# EAGLE design SHARKSKYFC (EAGLE 9.5.1)
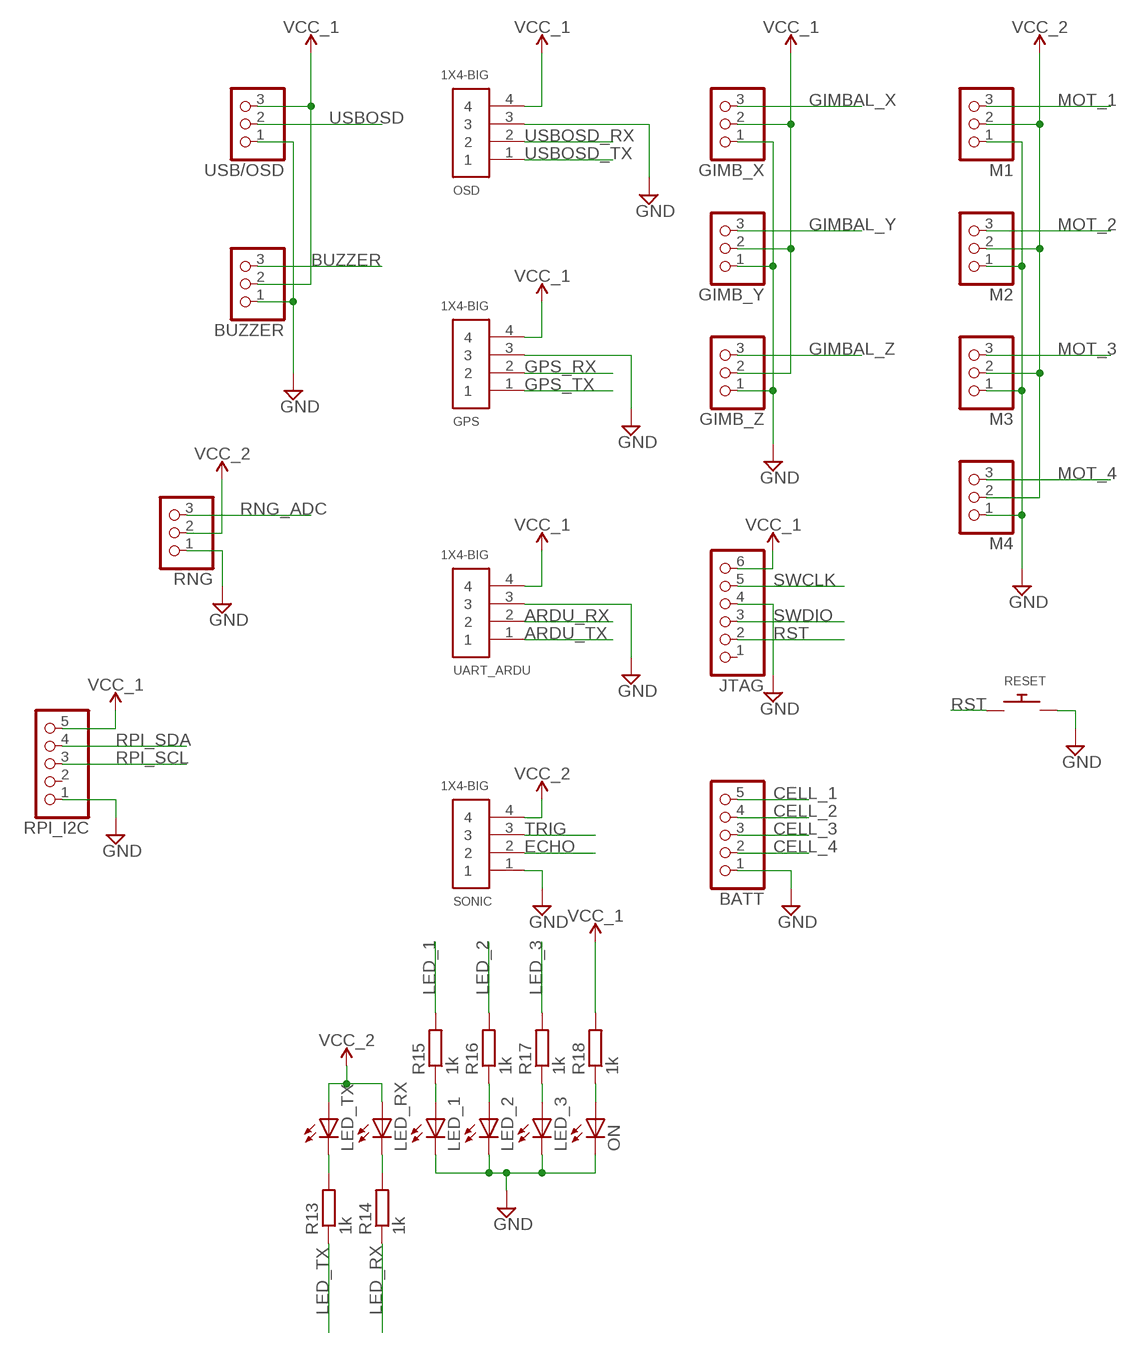
[diagram p0: schematic, sheet 1, part 1 of 2]
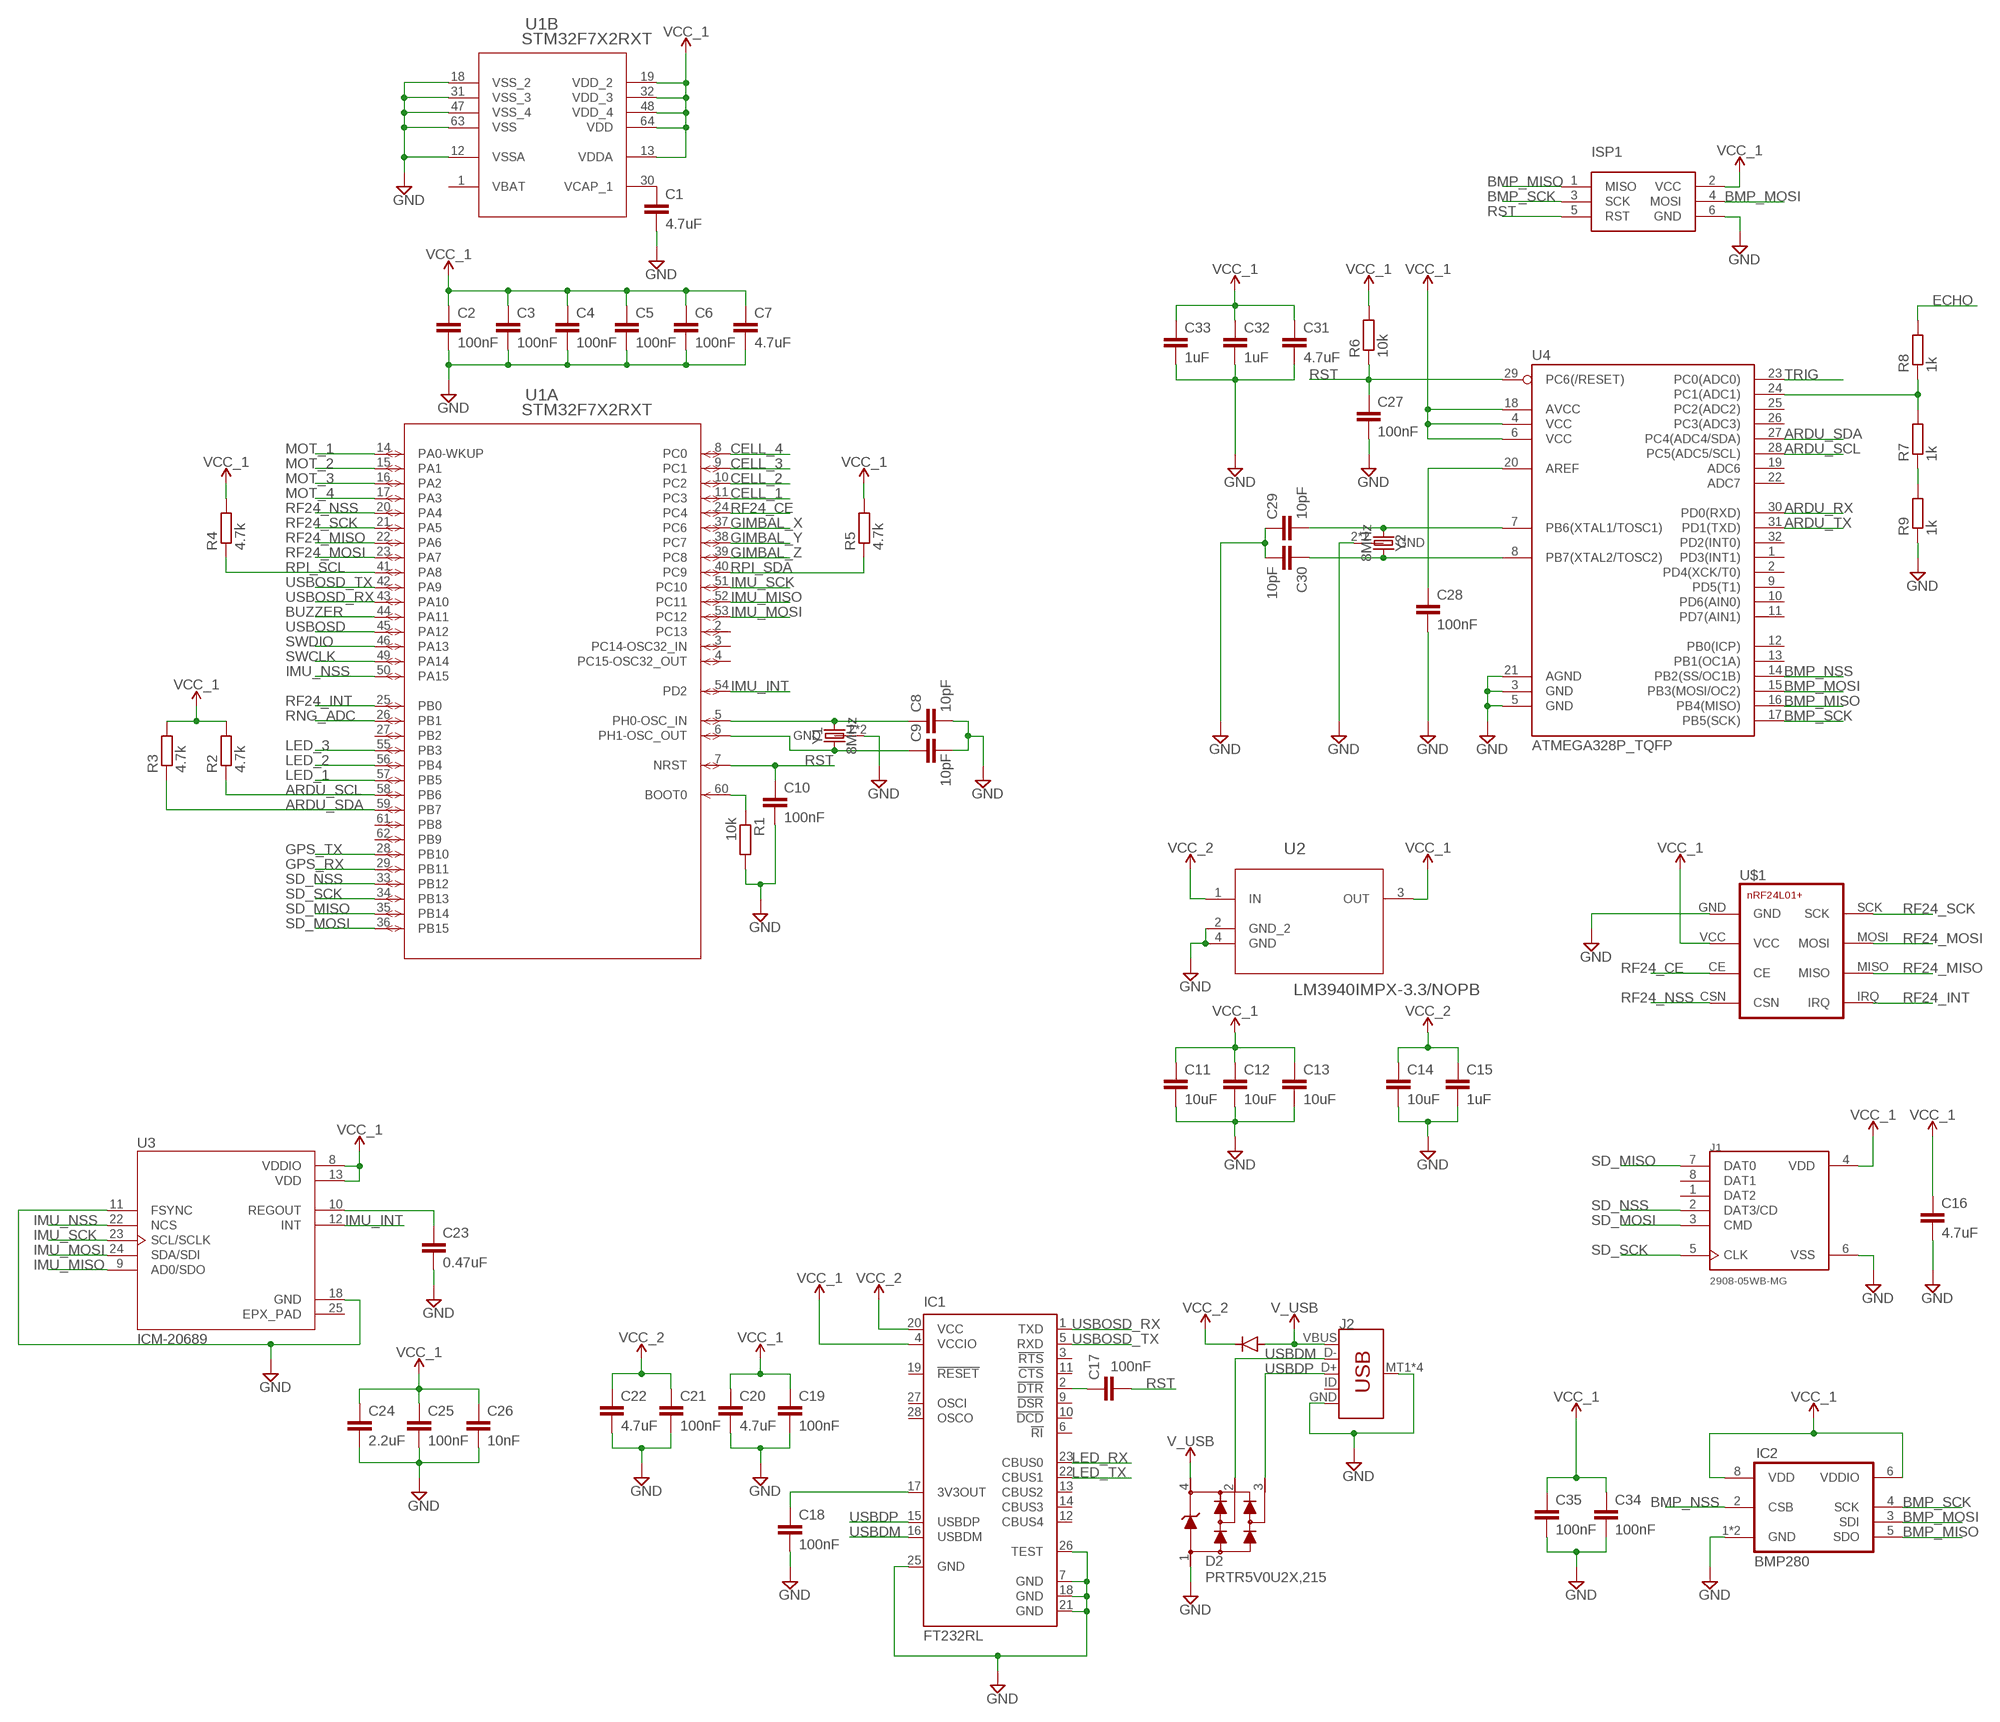
[diagram p1: schematic, sheet 1, part 2 of 2]

## Parts
BATT  PINHD-1X5  [1X05]
BUZZER  PINHD-1X3  [1X03]
C1  4.7uF  C-EUC0805  [C0805]
C2  100nF  C-EUC0805  [C0805]
C3  100nF  C-EUC0805  [C0805]
C4  100nF  C-EUC0805  [C0805]
C5  100nF  C-EUC0805  [C0805]
C6  100nF  C-EUC0805  [C0805]
C7  4.7uF  C-EUC0805  [C0805]
C8  10pF  C-EUC0805  [C0805]
C9  10pF  C-EUC0805  [C0805]
C10  100nF  C-EUC0805  [C0805]
C11  10uF  C-EUC0805  [C0805]
C12  10uF  C-EUC0805  [C0805]
C13  10uF  C-EUC0805  [C0805]
C14  10uF  C-EUC0805  [C0805]
C15  1uF  C-EUC0805  [C0805]
C16  4.7uF  C-EUC0805  [C0805]
C17  100nF  C-EUC0805  [C0805]
C18  100nF  C-EUC0805  [C0805]
C19  100nF  C-EUC0805  [C0805]
C20  4.7uF  C-EUC0805  [C0805]
C21  100nF  C-EUC0805  [C0805]
C22  4.7uF  C-EUC0805  [C0805]
C23  0.47uF  C-EUC0805  [C0805]
C24  2.2uF  C-EUC0805  [C0805]
C25  100nF  C-EUC0805  [C0805]
C26  10nF  C-EUC0805  [C0805]
C27  100nF  C-EUC0805  [C0805]
C28  100nF  C-EUC0805  [C0805]
C29  10pF  C-EUC0805  [C0805]
C30  10pF  C-EUC0805  [C0805]
C31  4.7uF  C-EUC0805  [C0805]
C32  1uF  C-EUC0805  [C0805]
C33  1uF  C-EUC0805  [C0805]
C34  100nF  C-EUC0805  [C0805]
C35  100nF  C-EUC0805  [C0805]
D1  DIODE-DO214BA  [DO214BA]
D2  PRTR5V0U2X,215  [SOT143B]
GIMB_X  PINHD-1X3  [1X03]
GIMB_Y  PINHD-1X3  [1X03]
GIMB_Z  PINHD-1X3  [1X03]
GPS  1X4-BIG  [1X04-BIG]
IC1  FT232RL  [SSOP28]
IC2  BMP280  [BMP280]
ISP1  AVRISP-6  [AVRISP]
J1  2908-05WB-MG  [3M_2908-05WB-MG]
J2  USB_MICRO-B_SMT  [USB-MICROB]
JTAG  PINHD-1X6  [1X06]
LED_1  LEDSMT1206  [1206]
LED_2  LEDSMT1206  [1206]
LED_3  LEDSMT1206  [1206]
LED_RX  LEDSMT1206  [1206]
LED_TX  LEDSMT1206  [1206]
M1  PINHD-1X3  [1X03]
M2  PINHD-1X3  [1X03]
M3  PINHD-1X3  [1X03]
M4  PINHD-1X3  [1X03]
ON  LEDSMT1206  [1206]
OSD  1X4-BIG  [1X04-BIG]
R1  10k  R-EU_R0603  [R0603]
R2  4.7k  R-EU_R0603  [R0603]
R3  4.7k  R-EU_R0603  [R0603]
R4  4.7k  R-EU_R0603  [R0603]
R5  4.7k  R-EU_R0603  [R0603]
R6  10k  R-EU_R0603  [R0603]
R7  1k  R-EU_R0603  [R0603]
R8  1k  R-EU_R0603  [R0603]
R9  1k  R-EU_R0603  [R0603]
R13  1k  R-EU_R0603  [R0603]
R14  1k  R-EU_R0603  [R0603]
R15  1k  R-EU_R0603  [R0603]
R16  1k  R-EU_R0603  [R0603]
R17  1k  R-EU_R0603  [R0603]
R18  1k  R-EU_R0603  [R0603]
RESET  SWITCH_PUSHBUTTONC&K_KSS  [BTN_CK_KSS]
RNG  PINHD-1X3  [1X03]
RPI_I2C  PINHD-1X5  [1X05]
SONIC  1X4-BIG  [1X04-BIG]
U1  STM32F7X2RXT  [LQFP64-10X10MM]
U2  LM3940IMPX-3.3/NOPB  [SOT230P696X180-4N]
U3  ICM-20689  [QFN50P400X400X95-25N]
U4  ATMEGA328P_TQFP  [TQFP32-08]
U$1  NRF24L01+  [NRF24L01+]
UART_ARDU  1X4-BIG  [1X04-BIG]
USB/OSD  PINHD-1X3  [1X03]
Y1  8MHz  CRYSTAL-8MHZSMD-5X3.2  [CRYSTAL-SMD-5X3.2-4PAD]
Y2  8MHz  CRYSTAL-8MHZSMD-5X3.2  [CRYSTAL-SMD-5X3.2-4PAD]

## Nets
ARDU_RX: U4.30(PD0(RXD)) UART_ARDU.2
ARDU_SCL: R2.1 U1.58(A:PB6) U4.28(PC5(ADC5/SCL))
ARDU_SDA: R3.1 U1.59(A:PB7) U4.27(PC4(ADC4/SDA))
ARDU_TX: U4.31(PD1(TXD)) UART_ARDU.1
BMP_MISO: IC2.5(SDO) ISP1.1(MISO) U4.16(PB4(MISO))
BMP_MOSI: IC2.3(SDI) ISP1.4(MOSI) U4.15(PB3(MOSI/OC2))
BMP_NSS: IC2.2(CSB) U4.14(PB2(SS/OC1B))
BMP_SCK: IC2.4(SCK) ISP1.3(SCK) U4.17(PB5(SCK))
BUZZER: BUZZER.3 U1.44(A:PA11)
CELL_1: BATT.5 U1.11(A:PC3)
CELL_2: BATT.4 U1.10(A:PC2)
CELL_3: BATT.3 U1.9(A:PC1)
CELL_4: BATT.2 U1.8(A:PC0)
E: R7.2 R8.1 U4.24(PC1(ADC1))
ECHO: R8.2 SONIC.2
GIMBAL_X: GIMB_X.3 U1.37(A:PC6)
GIMBAL_Y: GIMB_Y.3 U1.38(A:PC7)
GIMBAL_Z: GIMB_Z.3 U1.39(A:PC8)
GND: BATT.1 BUZZER.1 C1.2 C2.2 C3.2 C4.2 C5.2 C6.2 C7.2 C8.2 C9.2 C10.2 C11.2 C12.2 C13.2 C14.2 C15.2 C16.2 C18.2 C19.2 C20.2 C21.2 C22.2 C23.2 C24.2 C25.2 C26.2 C27.2 C28.2 C29.1 C30.2 C31.2 C32.2 C33.2 C34.2 C35.2 D2.1 GIMB_X.1 GIMB_Y.1 GIMB_Z.1 GPS.3 IC1.7(GND) IC1.18(GND) IC1.21(GND) IC1.25(GND) IC1.26(TEST) IC2.1(GND) IC2.7(GND) ISP1.6(GND) J1.6(VSS) J2.GND J2.MT1(SHIELD) J2.MT2(SHIELD) J2.P$1(SHIELD) J2.P$2(SHIELD) JTAG.4 LED_1.C LED_2.C LED_3.C M1.1 M2.1 M3.1 M4.1 ON.C OSD.3 R1.2 R9.1 RESET.P$2 RNG.1 RPI_I2C.1 SONIC.1 U1.12(B:VSSA) U1.18(B:VSS_2) U1.31(B:VSS_3) U1.47(B:VSS_4) U1.63(B:VSS) U2.2(GND_2) U2.4(GND) U3.11(FSYNC) U3.18(GND) U4.3(GND) U4.5(GND) U4.21(AGND) U$1.GND UART_ARDU.3 USB/OSD.1 Y1.2(GND) Y1.4(GND) Y2.2(GND) Y2.4(GND)
GPS_RX: GPS.2 U1.29(A:PB11)
GPS_TX: GPS.1 U1.28(A:PB10)
IMU_INT: U1.54(A:PD2) U3.12(INT)
IMU_MISO: U1.52(A:PC11) U3.9(AD0/SDO)
IMU_MOSI: U1.53(A:PC12) U3.24(SDA/SDI)
IMU_NSS: U1.50(A:PA15) U3.22(NCS)
IMU_SCK: U1.51(A:PC10) U3.23(SCL/SCLK)
LED_1: R15.2 U1.57(A:PB5)
LED_2: R16.2 U1.56(A:PB4)
LED_3: R17.2 U1.55(A:PB3)
LED_RX: IC1.23(CBUS0) R14.1
LED_TX: IC1.22(CBUS1) R13.1
MOT_1: M1.3 U1.14(A:PA0-WKUP)
MOT_2: M2.3 U1.15(A:PA1)
MOT_3: M3.3 U1.16(A:PA2)
MOT_4: M4.3 U1.17(A:PA3)
N$1: C1.1 U1.30(B:VCAP_1)
N$2: C17.1 IC1.2(!DTR)
N$3: C9.1 U1.6(A:PH1-OSC_OUT) Y1.1
N$4: R1.1 U1.60(A:BOOT0)
N$5: C18.1 IC1.17(3V3OUT)
N$6: C23.1 U3.10(REGOUT)
N$8: C28.1 U4.20(AREF)
N$9: C29.2 U4.7(PB6(XTAL1/TOSC1)) Y2.1
N$10: C30.1 U4.8(PB7(XTAL2/TOSC2)) Y2.3
N$12: R7.1 R9.2
N$14: LED_TX.C R13.2
N$16: LED_RX.C R14.2
N$17: LED_1.A R15.1
N$18: LED_2.A R16.1
N$19: LED_3.A R17.1
N$20: ON.A R18.1
N$49: C8.1 U1.5(A:PH0-OSC_IN) Y1.3
RF24_CE: U1.24(A:PC4) U$1.CE
RF24_INT: U1.25(A:PB0) U$1.IRQ
RF24_MISO: U1.22(A:PA6) U$1.MISO
RF24_MOSI: U1.23(A:PA7) U$1.MOSI
RF24_NSS: U1.20(A:PA4) U$1.CSN
RF24_SCK: U1.21(A:PA5) U$1.SCK
RNG_ADC: RNG.3 U1.26(A:PB1)
RPI_SCL: R4.1 RPI_I2C.3 U1.41(A:PA8)
RPI_SDA: R5.1 RPI_I2C.4 U1.40(A:PC9)
RST: C10.1 C17.2 C27.1 ISP1.5(RST) JTAG.2 R6.1 RESET.P$1 U1.7(A:NRST) U4.29(PC6(/RESET))
SD_MISO: J1.7(DAT0) U1.35(A:PB14)
SD_MOSI: J1.3(CMD) U1.36(A:PB15)
SD_NSS: J1.2(DAT3/CD) U1.33(A:PB12)
SD_SCK: J1.5(CLK) U1.34(A:PB13)
SWCLK: JTAG.5 U1.49(A:PA14)
SWDIO: JTAG.3 U1.46(A:PA13)
TRIG: SONIC.3 U4.23(PC0(ADC0))
USBDM: D2.2 IC1.16(USBDM) J2.D-
USBDP: D2.3 IC1.15(USBDP) J2.D+
USBOSD: U1.45(A:PA12) USB/OSD.2
USBOSD_RX: IC1.1(TXD) OSD.2 U1.43(A:PA10)
USBOSD_TX: IC1.5(RXD) OSD.1 U1.42(A:PA9)
V_USB: D1.A D2.4 J2.VBUS
VCC_1: BUZZER.2 C2.1 C3.1 C4.1 C5.1 C6.1 C7.1 C11.1 C12.1 C13.1 C16.1 C19.1 C20.1 C24.1 C25.1 C26.1 C31.1 C32.1 C33.1 C34.1 C35.1 GIMB_X.2 GIMB_Y.2 GIMB_Z.2 GPS.4 IC1.4(VCCIO) IC2.6(VDDIO) IC2.8(VDD) ISP1.2(VCC) J1.4(VDD) JTAG.6 OSD.4 R2.2 R3.2 R4.2 R5.2 R6.2 R18.2 RPI_I2C.5 U1.13(B:VDDA) U1.19(B:VDD_2) U1.32(B:VDD_3) U1.48(B:VDD_4) U1.64(B:VDD) U2.3(OUT) U3.8(VDDIO) U3.13(VDD) U4.4(VCC) U4.6(VCC) U4.18(AVCC) U$1.VCC UART_ARDU.4 USB/OSD.3
VCC_2: C14.1 C15.1 C21.1 C22.1 D1.C IC1.20(VCC) LED_RX.A LED_TX.A M1.2 M2.2 M3.2 M4.2 RNG.2 SONIC.4 U2.1(IN)
Unconnected: IC1.3(!RTS) IC1.6(!RI) IC1.9(!DSR) IC1.10(!DCD) IC1.11(!CTS) IC1.12(CBUS4) IC1.13(CBUS2) IC1.14(CBUS3) IC1.19(!RESET) IC1.27(OSCI) IC1.28(OSCO) J1.1(DAT2) J1.8(DAT1) J2.ID JTAG.1 RPI_I2C.2 U1.2(A:PC13) U1.3(A:PC14-OSC32_IN) U1.4(A:PC15-OSC32_OUT) U1.27(A:PB2) U1.61(A:PB8) U1.62(A:PB9) U4.1(PD3(INT1)) U4.2(PD4(XCK/T0)) U4.9(PD5(T1)) U4.10(PD6(AIN0)) U4.11(PD7(AIN1)) U4.12(PB0(ICP)) U4.13(PB1(OC1A)) U4.19(ADC6) U4.22(ADC7) U4.25(PC2(ADC2)) U4.26(PC3(ADC3)) U4.32(PD2(INT0))

## Power pins joined to a net without a drawn wire
EPX_PAD: U3.25(EPX_PAD)
VBAT: U1.1(B:VBAT)

## Library data of the parts
BATT RPI_I2C = pinhead:PINHD-1X5: PIN HEADER
BUZZER GIMB_X GIMB_Y GIMB_Z M1-M4 RNG USB/OSD = adafruit:PINHD-1X3: PIN HEADER
C1-C35 = rcl:C-EU: CAPACITOR, European symbol; SPICEPREFIX: C
D1 = diode:DIODE-: DIODE
D2 = PRTR5V0U2X_215:PRTR5V0U2X,215: Ultra low capacitance double rail-to-rail ESD protection diode; AVAILABILITY: Unavailable; DESCRIPTION: PRTR5V0U2X Series 9 V 16 pF Rail-to-Rail ESD Protection Diode - SOT-143B; MF: Nexperia USA; MP: PRTR5V0U2X,215; PACKAGE: SOT-143 NXP Semiconductors; PRICE: None
GPS OSD SONIC UART_ARDU = adafruit:1X4: 4-pin connector
IC1 = ftdichip:FT232R: Source: http://www.ftdichip.com/Documents/DataSheets/DS_FT232R_v104.pdf; MPN: FT232RL; OC_FARNELL: 1146032; OC_NEWARK: 91K9918
IC2 = bosch-bmp280:BMP280: The BMP280 is an absolute barometric pressure sensor especially designed for mobile applications. The sensor module is housed in an extremely compact 8-pin metal-lid LGA package with a footprint of only 2.0 × 2.5 mm2 and 0.95 mm package height. Its small dimensions and its low power consumption of 2.7 μA @1Hz allow the implementation in battery driven devices such as mobile phones, GPS modules or watches. The library has been designed by Richard Magdycz <https://www.facebook.com/groups/eaglecadsoftUK>
ISP1 = adafruit:AVRISP: AVR ISP HEADER Standard 6 pin header for AVR programming
J1 = 2908-05WB-MG:2908-05WB-MG: 2908-05WB-MG Conn Micro S D Card HDR 8 POS 1.1mm So lder RA SMD T/R 0.5A RoHS; AVAILABILITY: Unavailable; DESCRIPTION: 2908-05WB-MG Conn Micro S D Card HDR 8 POS 1.1mm So lder RA SMD T/R 0.5A RoHS; MF: 3M; MP: 2908-05WB-MG; PACKAGE: None; PRICE: None
J2 = SparkFun-Connectors:USB_MICRO-B: USB Type Micro-B Connector Male/female and PTH/SMT variants SparkFun Products: SparkFun microB USB Breakout <https://www.sparkfun.com/products/12035> SparkFun USB microB Plug Breakout <https://www.sparkfun.com/products/10031> SparkFun ESP8266 Thing <https://www.sparkfun.com/products/13231>; PROD_ID: CONN-09505; SF_ID: PRT-08533
JTAG = adafruit:PINHD-1X6: PIN HEADER
LED_1-LED_3 LED_RX LED_TX ON = adafruit:LED: LED OSRAM: - CHIPLED LG R971, LG N971, LY N971, LG Q971, LY Q971, LO R971, LY R971 LH N974, LH R974 LS Q976, LO Q976, LY Q976 LO Q996 - Hyper CHIPLED LW Q18S LB Q993, LB Q99A, LB R99A - SideLED LS A670, LO A670, LY A670, LG A670, LP A670 LB A673, LV A673, LT A673, LW A673 LH A674 LY A675 LS A676, LA A676, LO A676, LY A676, LW A676 LS A679, LY A679, LG A679 - Hyper Micro SIDELED® LS Y876, LA Y876, LO Y876, LY Y876 LT Y87S - SmartLED LW L88C, LW L88S LB L89C, LB L89S, LG L890 LS L89K, LO L89K, LY L89K LS L896, LA L896, LO L896, LY L896 - TOPLED LS T670, LO T670, LY T670, LG T670, LP T670 LSG T670, LSP T670, LSY T670, LOP T670, LYG T670 LG T671, LOG T671, LSG T671 LB T673, LV T673, LT T673, LW T673 LH T674 LS T676, LA T676, LO T676, LY T676, LB T676, LH T676, LSB T676, LW T676 LB T67C, LV T67C, LT T67C, LS T67K, LO T67K, LY T67K, LW E67C LS E67B, LA E67B, LO E67B, LY E67B, LB E67C, LV E67C, LT E67C LW T67C LS T679, LY T679, LG T679 LS T770, LO T770, LY T770, LG T770, LP T770 LB T773, LV T773, LT T773, LW T773 LH T774 LS E675, LA E675, LY E675, LS T675 LS T776, LA T776, LO T776, LY T776, LB T776 LHGB T686 LT T68C, LB T68C - Hyper Mini TOPLED® LB M676 - Mini TOPLED Santana® LG M470 LS M47K, LO M47K, LY M47K Source: http://www.osram.convergy.de/
R1-R9 R13-R18 = resistor:R-EU_: RESISTOR, European symbol
RESET = adafruit:SWITCH_PUSHBUTTON: Buttons SOFTTOUCHSMD_SJ - Soft touch temporary push button (Super Junk Akihabara) Compatible with SKPMANE010 [Mouser: 688-SKPMAN] C&K_KSS = Digikey: KSS221GLFS
U1 = STMF22RET6:STM32F7X2RXT; MANUFACTURER_PART_NUMBER: STM32F7X2RXT; VENDOR: STMicroelectronics
U2 = LM3940IMPX-3.3_NOPB:LM3940IMPX-3.3/NOPB: Low Dropout Regulator; AVAILABILITY: Unavailable; DESCRIPTION: 1A Low Dropout egulator for 5V to 3.3V Conversion 4-SOT-223 -40 to 125; MF: Texas Instruments; MP: LM3940IMPX-3.3/NOPB; PACKAGE: SOT-223-4 Texas Instruments; PRICE: None
U3 = ICM-20689:ICM-20689: 6-Axis Drone/Vr/Iot Solution (Pi); AVAILABILITY: Unavailable; DESCRIPTION: 6-Axis Drone/Vr/Iot Solution _Pi; MF: TDK InvenSense; MP: ICM-20689; PACKAGE: QFN-24 InvenSense; PRICE: None
U4 = SparkFun-IC-Microcontroller:ATMEGA328P_TQFP: Popular 328P in QFP Storefront component: ATmega328 - TQFP <https://www.sparkfun.com/products/13448> (COM-13448) Datasheet <http://www.sparkfun.com/datasheets/Components/SMD/ATMega328.pdf> SparkFun Products SparkFun RedBoard - Programmed with Arduino <https://www.sparkfun.com/products/12757> (DEV-12757) Arduino Pro Mini 328 - 5V/16MHz <https://www.sparkfun.com/products/11113> (DEV-11113) Arduino Pro Mini 328 - 3.3V/8MHz <https://www.sparkfun.com/products/11114> (DEV-11114) SparkFun OpenLog <https://www.sparkfun.com/products/13712> (DEV-13712) SparkFun MicroView - OLED Arduino Module <https://www.sparkfun.com/products/12923> (DEV-12923) SparkFun Digital Sandbox <https://www.sparkfun.com/products/12651> (DEV-12651) SparkFun PicoBoard <https://www.sparkfun.com/products/11888> (WIG-11888) Arduino Fio <https://www.sparkfun.com/products/10116> (DEV-10116) LilyPad Arduino 328 Main Board <https://www.sparkfun.com/products/13342> (DEV-13342) SparkFun RedStick <https://www.sparkfun.com/products/13741> (DEV-13741) LilyPad MP3 <https://www.sparkfun.com/products/11013> (DEV-11013) LilyPad Arduino SimpleSnap <https://www.sparkfun.com/products/10941> (DEV-10941) SparkFun Stepoko <https://www.sparkfun.com/products/13899> (ROB-13899) SparkFun Geiger Counter <https://www.sparkfun.com/products/11345> (SEN-11345) SparkFun EL Sequencer <https://www.sparkfun.com/products/12781> (COM-12781) Arduino Pro 328 - 5V/16MHz <https://www.sparkfun.com/products/10915> (DEV-10915) CryptoCape <https://www.sparkfun.com/products/12773> (DEV-12773) SparkFun IR Thermometer Evaluation Board - MLX90614 <https://www.sparkfun.com/products/10740> (SEN-10740) SparkFun RedBot Mainboard <https://www.sparkfun.com/products/12097> (ROB-12097) Arduino Pro 328 - 3.3V/8MHz <https://www.sparkfun.com/products/10914> (DEV-10914) SparkFun Block for Intel® Edison - Arduino <https://www.sparkfun.com/products/13036> (DEV-13036) SparkFun Simon Says - Surface Mount Soldering Kit <https://www.sparkfun.com/products/10935> (KIT-10935) SparkFun 7-Segment Serial Display - Red <https://www.sparkfun.com/products/11441> (COM-11441) SparkFun 7-Segment Serial Display - White <https://www.sparkfun.com/products/11629> (COM-11629) SparkFun 7-Segment Serial Display - Yellow <https://www.sparkfun.com/products/11443> (COM-11443) SparkFun 7-Segment Serial Display - Kelly Green <https://www.sparkfun.com/products/11440> (COM-11440) SparkFun 7-Segment Serial Display - Blue <https://www.sparkfun.com/products/11442> (COM-11442) SparkFun OpenSegment Serial Display - 20mm (Blue) <https://www.sparkfun.com/products/11647> (COM-11647) SparkFun OpenSegment Serial Display - 20mm (Green) <https://www.sparkfun.com/products/11646> (COM-11646) SparkFun OpenSegment Serial Display - 20mm (White) <https://www.sparkfun.com/products/11648> (COM-11648) SparkFun OpenSegment Serial Display - 20mm (Red) <https://www.sparkfun.com/products/11644> (COM-11644) SparkFun OpenSegment Serial Display - 20mm (Yellow) <https://www.sparkfun.com/products/11645> (COM-11645) SparkFun OpenSegment Shield <https://www.sparkfun.com/products/13190> (DEV-13190); PROD_ID: IC-09069
U$1 = NRF24l01+:NRF24L01+: nRF24L01+ Transceiver Module
Y1 Y2 = SparkFun-Clocks_:CRYSTAL-8MHZ: 8MHz Crystal Datasheet Example <http://www.futureelectronics.com/en/technologies/electromechanical/timing-devices/crystals/Pages/6008189-ABM3B-8.000MHZ-B2-T.aspx?IM=0> Frequency: 8MHz Frequency Tolerance: ±20ppm Load Capacitance: 18pF SparkFun Products: Pro Micro -3.3V/8MHz <https://www.sparkfun.com/products/12587> WAV Trigger <https://www.sparkfun.com/products/13660>; PROD_ID: XTAL-09431

## Net classes
0 default: width 0.305 mm

## Board
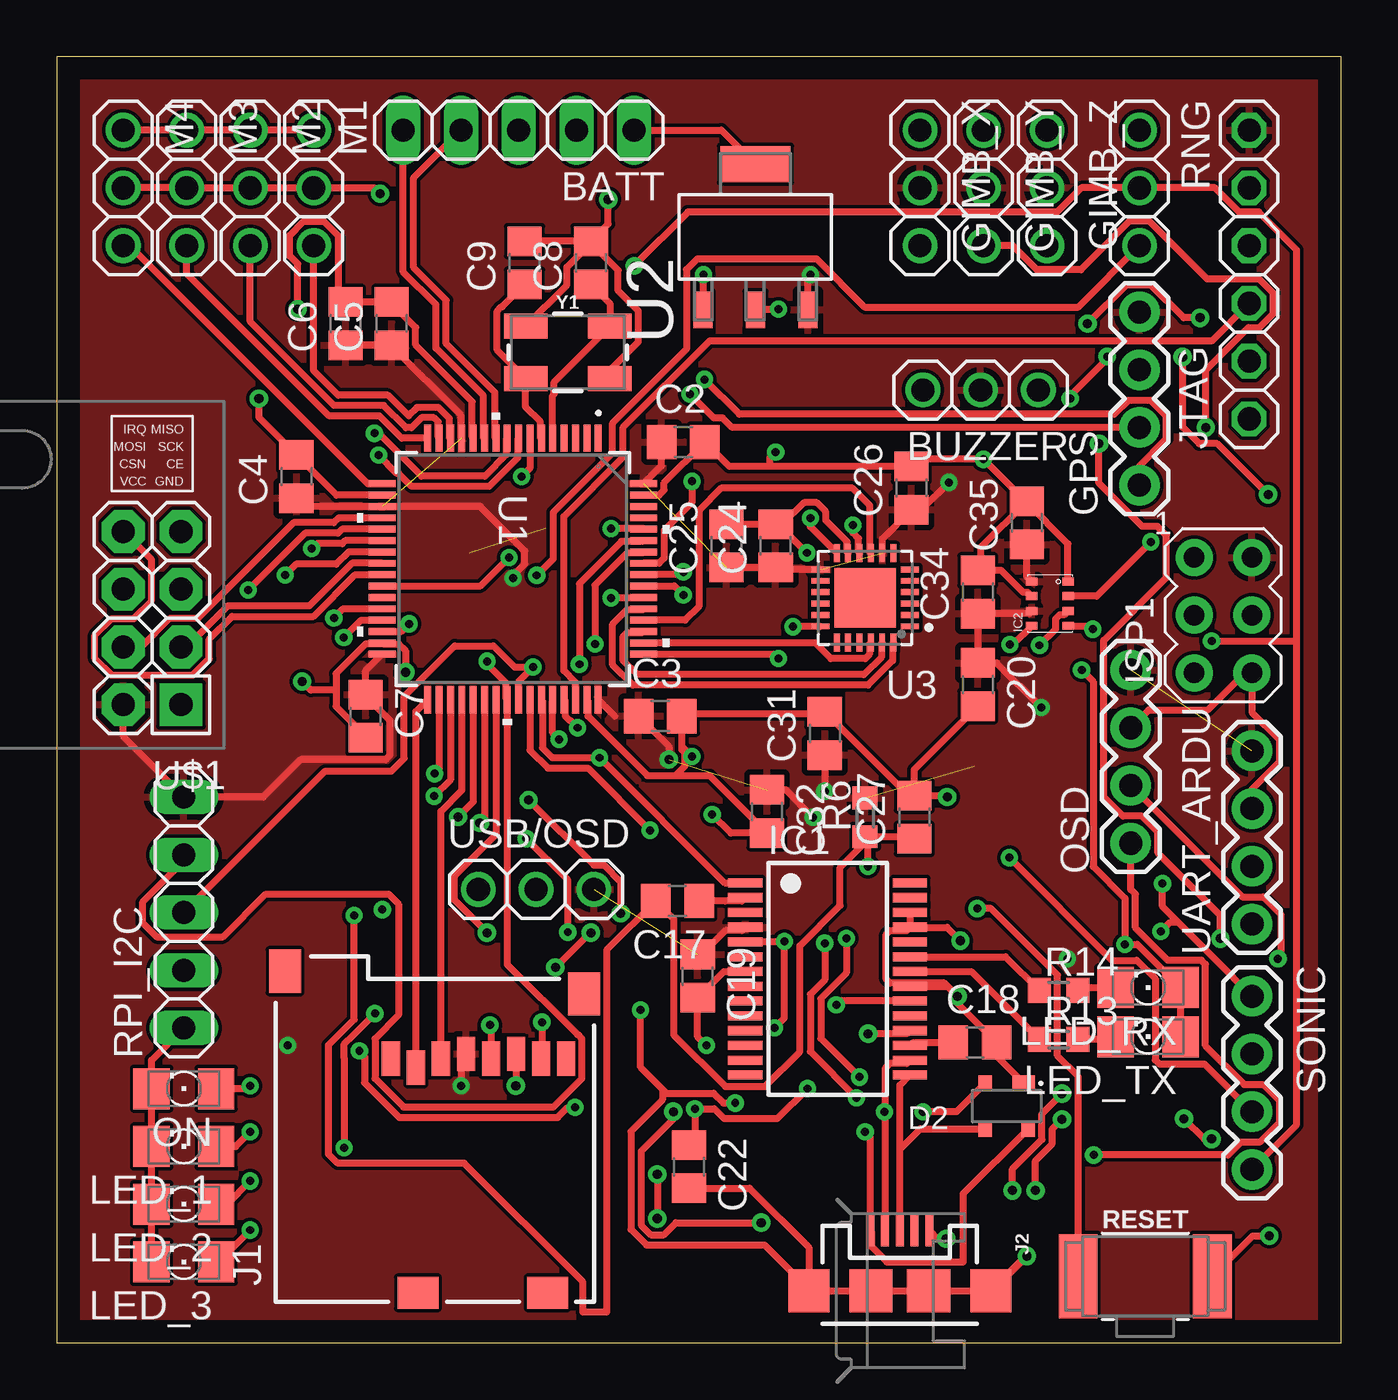
[diagram p2: board, top side]
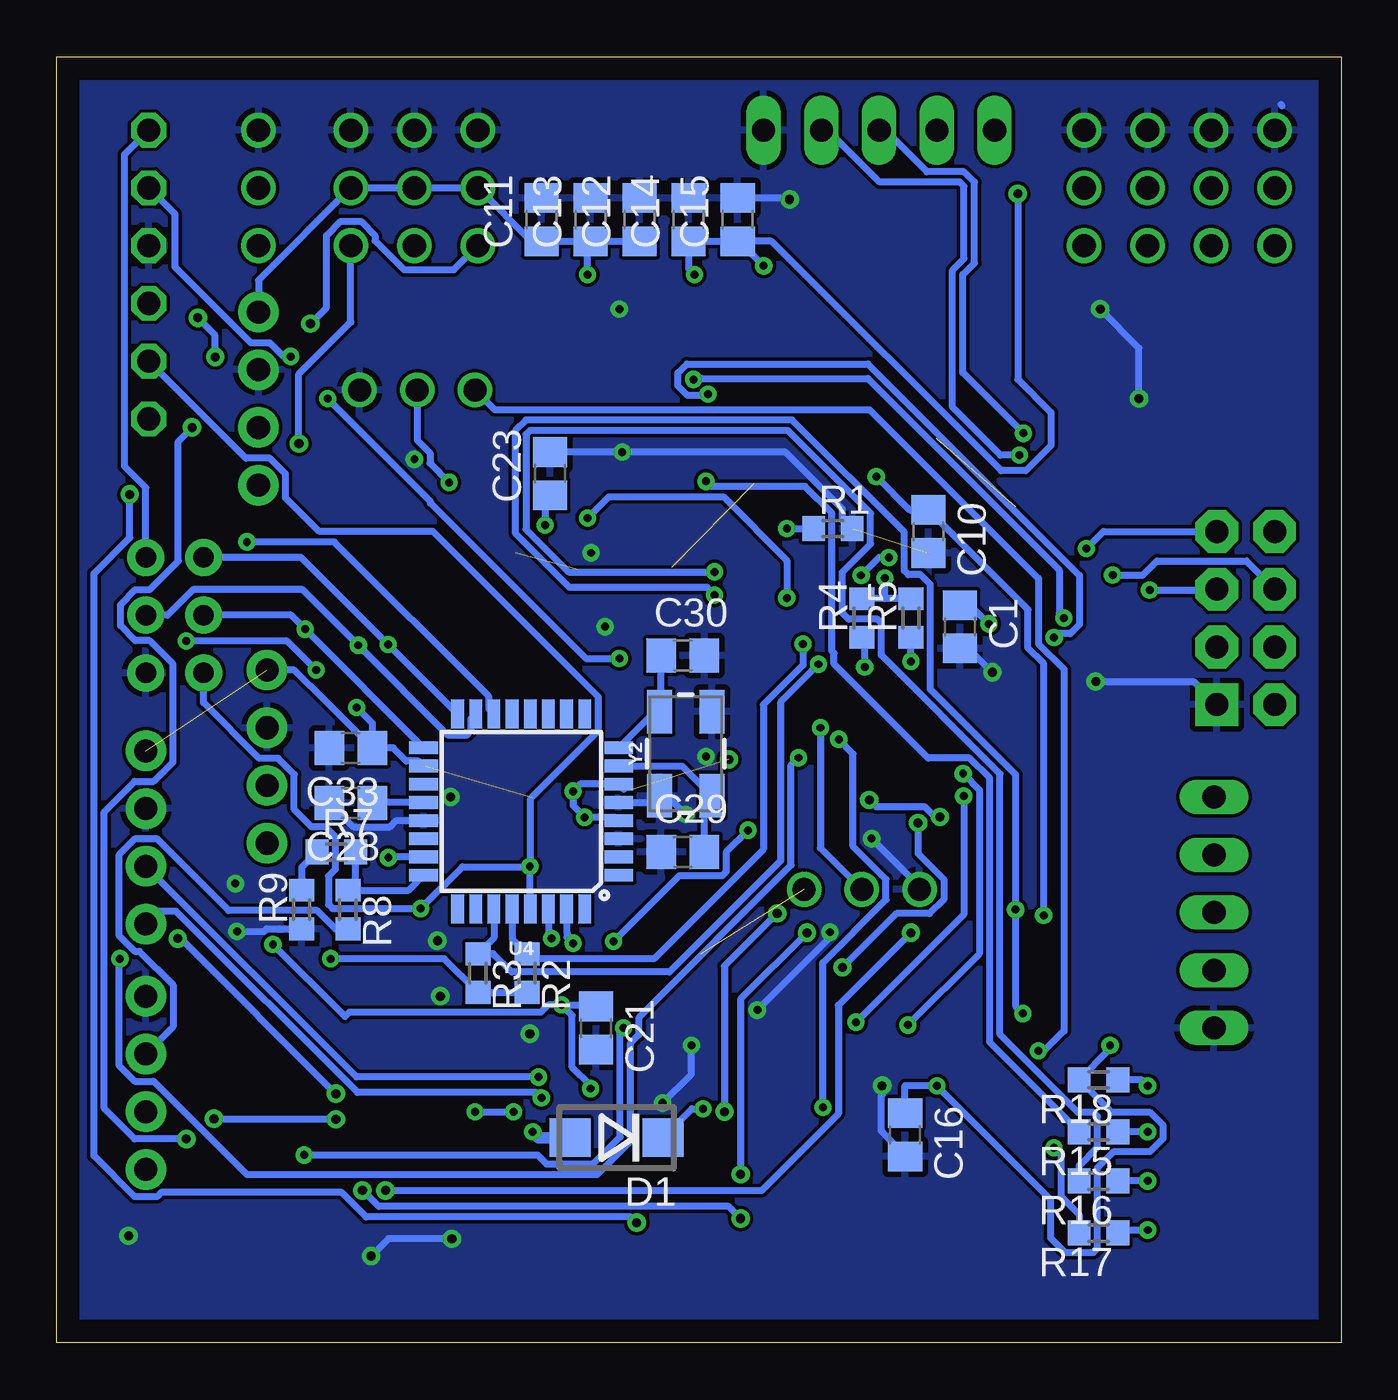
[diagram p3: board, bottom side, seen from below]

Size 56.5 x 56.57 mm. Coordinates in mm from the lower left corner, seen from the top.
Outline: 0,0 56.5,0 56.5,56.57 0,56.57 0,0
Copper layers (1*16): Top 0.035mm / dielectric 1.5mm / Bottom 0.035mm
Design rules "default": minimum track width 6mil, minimum drill 0.35mm, track to track 6mil, track to pad 6mil, pad to pad 6mil, via to via 6mil, smd to smd 6mil, copper to edge 40mil, drill to drill 6mil, minimum pad ring 10mil, minimum via ring 8mil, stop-mask expansion 4mil, vias tented up to drill 0mil, thermal gap 10mil

### Footprints (pad centres in the part's own frame; a part is rotated, then mirrored left to right if it is on the bottom)
1X05 = drill 1.016 long: 1 -5.08,0; 2 -2.54,0; 3 0,0; 4 2.54,0; 5 5.08,0
1X03 = drill 1.016: 1 -2.54,0; 2 0,0; 3 2.54,0
C0805 = smd 1.3 x 1.5: 1 -0.95,0; 2 0.95,0
DO214BA = smd 1.8 x 1.7: A 2.05,0; C -2.05,0
SOT143B = smd 1 x 0.7: 1 -0.75,-1 | smd 0.6 x 0.7: 2 0.95,-1; 3 0.95,1; 4 -0.95,1
1X04-BIG = drill 1.016 pad 1.778: 1 0,0; 2 2.54,0; 3 5.08,0; 4 7.62,0
SSOP28 = smd 0.4 x 1.5: 1 -4.225,-3.625; 2 -3.575,-3.625; 3 -2.925,-3.625; 4 -2.275,-3.625; 5 -1.625,-3.625; 6 -0.975,-3.625; 7 -0.325,-3.625; 8 0.325,-3.625; 9 0.975,-3.625; 10 1.625,-3.625; 11 2.275,-3.625; 12 2.925,-3.625; 13 3.575,-3.625; 14 4.225,-3.625; 15 4.225,3.625; 16 3.575,3.625; 17 2.925,3.625; 18 2.275,3.625; 19 1.625,3.625; 20 0.975,3.625; 21 0.325,3.625; 22 -0.325,3.625; 23 -0.975,3.625; 24 -1.625,3.625; 25 -2.275,3.625; 26 -2.925,3.625; 27 -3.575,3.625; 28 -4.225,3.625
BMP280 = smd 0.35 x 0.5: 1 0.975,-0.8; 2 0.325,-0.8; 3 -0.325,-0.8; 4 -0.975,-0.8; 5 -0.975,0.8; 6 -0.325,0.8; 7 0.325,0.8; 8 0.975,0.8
AVRISP = drill 0.9 pad 1.626: 1 -1.27,2.54; 2 1.27,2.54; 3 -1.27,0; 4 1.27,0; 5 -1.27,-2.54; 6 1.27,-2.54
3M_2908-05WB-MG = smd 0.8 x 1.5: 1 -1.94,3.1; 2 -0.84,2.7; 3 0.26,3.1; 4 1.36,3.3; 5 2.46,3.1; 6 3.56,3.3; 7 4.66,3.1; 8 5.76,3.1 | smd 1.4 x 1.9: P$1 6.55,5.95; P$2 -6.6,6.95 | smd 1.8 x 1.4: P$3 4.95,-7.2; P$4 -0.75,-7.2
USB-MICROB = smd 1.4 x 0.35: D+ -2.65,0; D- -2.65,-0.65; GND -2.65,1.3; ID -2.65,0.65; VBUS -2.65,-1.3 | smd 1.9 x 1.8: MT1 0,-4; MT2 0,4 | smd 1.9 x 1.9: P$1 0,-1.27; P$2 0,1.27
1X06 = drill 1.016 octagon: 1 -6.35,0; 2 -3.81,0; 3 -1.27,0; 4 1.27,0; 5 3.81,0; 6 6.35,0
1206 = smd 1.6 x 1.803: A -1.422,0; C 1.422,0
R0603 = smd 1 x 1.1: 1 -0.85,0; 2 0.85,0
BTN_CK_KSS = smd 1.7 x 3.7: P$1 -2.95,0; P$2 2.95,0
LQFP64-10X10MM = smd 1.194 x 0.305: 1 -5.75,3.75; 2 -5.75,3.25; 3 -5.75,2.75; 4 -5.75,2.25; 5 -5.75,1.75; 6 -5.75,1.25; 7 -5.75,0.75; 8 -5.75,0.25; 9 -5.75,-0.25; 10 -5.75,-0.75; 11 -5.75,-1.25; 12 -5.75,-1.75; 13 -5.75,-2.25; 14 -5.75,-2.75; 15 -5.75,-3.25; 16 -5.75,-3.75; 33 5.75,-3.75; 34 5.75,-3.25; 35 5.75,-2.75; 36 5.75,-2.25; 37 5.75,-1.75; 38 5.75,-1.25; 39 5.75,-0.75; 40 5.75,-0.25; 41 5.75,0.25; 42 5.75,0.75; 43 5.75,1.25; 44 5.75,1.75; 45 5.75,2.25; 46 5.75,2.75; 47 5.75,3.25; 48 5.75,3.75 | smd 0.305 x 1.194: 17 -3.75,-5.75; 18 -3.25,-5.75; 19 -2.75,-5.75; 20 -2.25,-5.75; 21 -1.75,-5.75; 22 -1.25,-5.75; 23 -0.75,-5.75; 24 -0.25,-5.75; 25 0.25,-5.75; 26 0.75,-5.75; 27 1.25,-5.75; 28 1.75,-5.75; 29 2.25,-5.75; 30 2.75,-5.75; 31 3.25,-5.75; 32 3.75,-5.75; 49 3.75,5.75; 50 3.25,5.75; 51 2.75,5.75; 52 2.25,5.75; 53 1.75,5.75; 54 1.25,5.75; 55 0.75,5.75; 56 0.25,5.75; 57 -0.25,5.75; 58 -0.75,5.75; 59 -1.25,5.75; 60 -1.75,5.75; 61 -2.25,5.75; 62 -2.75,5.75; 63 -3.25,5.75; 64 -3.75,5.75
SOT230P696X180-4N = smd 1.6 x 0.838: 1 -3.2,2.311; 2 -3.2,0; 3 -3.2,-2.311 | smd 1.6 x 3.099: 4 3.2,0
QFN50P400X400X95-25N = smd 0.79 x 0.26: 1 -1.97,1.25; 2 -1.97,0.75; 3 -1.97,0.25; 4 -1.97,-0.25; 5 -1.97,-0.75; 6 -1.97,-1.25; 13 1.97,-1.25; 14 1.97,-0.75; 15 1.97,-0.25; 16 1.97,0.25; 17 1.97,0.75; 18 1.97,1.25 | smd 0.26 x 0.79: 7 -1.25,-1.97; 8 -0.75,-1.97; 9 -0.25,-1.97; 10 0.25,-1.97; 11 0.75,-1.97; 12 1.25,-1.97; 19 1.25,1.97; 20 0.75,1.97; 21 0.25,1.97; 22 -0.25,1.97; 23 -0.75,1.97; 24 -1.25,1.97 | smd 2.7 x 2.6: 25 0,0
TQFP32-08 = smd 1.27 x 0.559: 1 -4.293,2.8; 2 -4.293,2; 3 -4.293,1.2; 4 -4.293,0.4; 5 -4.293,-0.4; 6 -4.293,-1.2; 7 -4.293,-2; 8 -4.293,-2.8; 17 4.293,-2.8; 18 4.293,-2; 19 4.293,-1.2; 20 4.293,-0.4; 21 4.293,0.4; 22 4.293,1.2; 23 4.293,2; 24 4.293,2.8 | smd 0.559 x 1.27: 9 -2.8,-4.293; 10 -2,-4.293; 11 -1.2,-4.293; 12 -0.4,-4.293; 13 0.4,-4.293; 14 1.2,-4.293; 15 2,-4.293; 16 2.8,-4.293; 25 2.8,4.293; 26 2,4.293; 27 1.2,4.293; 28 0.4,4.293; 29 -0.4,4.293; 30 -1.2,4.293; 31 -2,4.293; 32 -2.8,4.293
NRF24L01+ = drill 1.016 pad 1.88 octagon: CE -11.43,1.27; CSN -8.89,1.27; IRQ -8.89,-3.81; MISO -11.43,-3.81; MOSI -8.89,-1.27; SCK -11.43,-1.27; VCC -8.89,3.81 | drill 1.016 pad 1.88 square: GND -11.43,3.81
CRYSTAL-SMD-5X3.2-4PAD = smd 1.9 x 1.1: 1 -1.85,-1.15; 2 1.85,-1.15; 3 1.85,1.15; 4 -1.85,1.15

### Placement (x,y rotation side)
BATT  20.32,53.34 180 top
BUZZER  40.64,41.91 180 top
C1  16.76,31.5 270 bottom
C2  27.56,39.62 0 top
C3  26.54,27.56 0 top
C4  10.54,38.1 90 top
C5  14.73,44.83 90 top
C6  12.7,44.83 90 top
C7  13.59,27.56 270 top
C8  23.49,47.5 90 top
C9  20.57,47.5 90 top
C10  18.16,35.69 270 bottom
C11  35.18,49.4 90 bottom
C12  30.86,49.4 90 bottom
C13  33.02,49.4 90 bottom
C14  28.7,49.4 90 bottom
C15  26.54,49.4 90 bottom
C16  19.18,9.14 270 bottom
C17  27.3,19.43 180 top
C18  40.39,13.21 0 top
C19  28.19,16.13 270 top
C20  40.51,28.96 270 top
C21  32.77,13.84 270 bottom
C22  27.81,7.75 270 top
C23  34.8,38.23 90 bottom
C24  31.62,35.05 90 top
C25  29.46,35.05 90 top
C26  37.59,37.59 90 top
C27  37.72,23.11 90 top
C28  43.56,23.75 180 bottom
C29  28.96,21.59 0 bottom
C30  28.96,30.23 0 bottom
C31  33.78,26.8 90 top
C32  31.24,23.37 270 top
C33  43.56,26.16 180 bottom
C34  40.51,33.02 90 top
C35  42.67,36.07 90 top
D1  31.88,9.02 180 bottom
D2  41.78,10.41 180 top
GIMB_X  37.97,50.8 270 top
GIMB_Y  40.77,50.8 270 top
GIMB_Z  43.56,50.8 270 top
GPS  47.62,37.72 90 top
IC1  33.91,16 270 top
IC2  43.69,32.51 90 top
ISP1  51.31,32 0 top
J1  16.64,9.4 0 top
J2  37.08,2.29 270 top
JTAG  52.45,46.99 90 top
LED_1  5.59,8.64 180 top
LED_2  5.59,6.1 180 top
LED_3  5.59,3.56 180 top
LED_RX  48.01,15.62 180 top
LED_TX  48.01,13.46 180 top
M1  11.3,50.8 270 top
M2  8.51,50.8 270 top
M3  5.71,50.8 270 top
M4  2.92,50.8 270 top
ON  5.59,11.18 180 top
OSD  47.24,21.97 90 top
R1  22.35,35.81 0 bottom
R2  35.81,16.26 270 bottom
R3  37.97,16.26 270 bottom
R4  21.08,31.88 90 bottom
R5  18.92,31.88 90 bottom
R6  35.56,23.11 90 top
R7  44.2,21.59 0 bottom
R8  43.69,19.05 270 bottom
R9  45.72,19.05 90 bottom
R13  44.07,13.34 0 top
R14  44.07,15.49 0 top
R15  10.67,9.27 180 bottom
R16  10.67,7.11 180 bottom
R17  10.67,4.83 180 bottom
R18  10.67,11.56 180 bottom
RESET  47.88,2.92 0 top
RNG  47.62,50.8 270 top
RPI_I2C  5.59,18.92 90 top
SONIC  52.58,15.24 270 top
U1  20.07,34.04 270 top
U2  30.73,48.64 90 top
U3  35.56,32.77 180 top
U4  36.07,23.37 180 bottom
U$1  -5.97,31.88 180 top
UART_ARDU  52.58,18.41 90 top
USB/OSD  21.08,19.94 0 top
Y1  22.48,43.56 0 top
Y2  28.83,25.91 90 bottom

### Tracks (layer width: path | path; a pad name or v marks a point on that pad's centre or on a via)
ARDU_RX  (via drill 0.35)
  Top 0.305: v34.73,17.78 34.73,16.27 33.61,15.14 33.61,13.38 v35.31,11.68
  Bottom 0.305: U4.30 34.87,17.91 v34.73,17.78 | v35.31,11.68 43.31,11.68 UART_ARDU.2
ARDU_SCL  (via drill 0.35)
  Top 0.305: U1.58 25.77,34.74 25.09,34.74 23.67,33.32 v23.67,30.73
  Bottom 0.305: U4.28 36.47,17.76 R2.1 35.6,16.89 30.23,16.89 25.41,21.71 25.41,28.07 23.67,29.81 v23.67,30.73
ARDU_SDA  (via drill 0.35)
  Top 0.305: U1.59 25.77,35.24 24.84,35.24 22.99,33.39 v22.99,29.84
  Bottom 0.305: U4.27 37.27,17.81 R3.1 37.3,17.11 36.49,16.3 29.55,16.3 24.65,21.2 24.65,28.18 v22.99,29.84
ARDU_TX  (via drill 0.35)
  Top 0.305: v33.78,17.57 33.78,15.96 33.15,15.33 33.15,12.8 v35.18,10.78
  Bottom 0.305: U4.31 34.07,18.08 34.05,18.06 34.05,17.84 v33.78,17.57 | v35.18,10.78 35.41,11 43.27,11 51.25,18.98 52.01,18.98 UART_ARDU.1
BMP_MISO  (via drill 0.35)
  Top 0.305: IC2.5 42.07,30.72 v41.93,30.72
  Bottom 0.305: U4.16 v41.93,30.72 45.75,34.54 ISP1.1
BMP_MOSI  (via drill 0.35)
  Top 0.305: v43.23,30.68 43.93,31.38 43.93,31.84 44.11,32.02 44.32,32.02 IC2.3
  Bottom 0.305: U4.15 38.28,27.45 38.28,26.9 38.46,26.72 39.27,26.72 v43.23,30.68 45.67,33.12 50.5,33.12 51.62,32 ISP1.4
BMP_NSS  (via drill 0.35)
  Top 0.305: v48.13,35.23 45.74,32.84 IC2.2
  Bottom 0.305: U4.14 37.48,27.88 37.48,28.42 44.29,35.23 v48.13,35.23
BMP_SCK  (via drill 0.35)
  Top 0.305: IC2.4 45.42,31.54 v45.58,31.39
  Bottom 0.305: U4.17 v45.58,31.39 46.2,32 ISP1.3
BUZZER  (via drill 0.35)
  Top 0.305: v13.31,12.83 13.53,12.61 13.53,11.43 15.06,9.91 22.03,9.91 22.48,10.35 v22.8,10.35 | v22.1,26.54 21.82,26.83 U1.44
  Bottom 0.305: BUZZER.3 37.24,41.05 20.74,41.05 13.31,33.62 13.31,30.74 12.19,29.63 12.19,13.72 13.07,12.83 v13.31,12.83 | v22.8,10.35 22.8,16.72 20.02,19.5 20.02,20.38 21.46,21.83 21.46,25.91 v22.1,26.54
CELL_1
  Top 0.305: U1.11 18.77,39.83 18.77,41.65 16.68,43.75 16.68,45.67 15.24,47.1 BATT.5
CELL_2
  Top 0.305: U1.10 19.27,39.83 19.27,41.8 17.13,43.94 17.13,45.86 15.7,47.29 15.7,51.26 BATT.4
CELL_3  (via drill 0.35)
  Top 0.305: U1.9 19.77,39.74 19.77,39.06 18.83,38.12 16.04,38.12 14.16,40.01 v13.97,40.01
  Bottom 0.305: v13.97,40.01 16.64,42.67 16.64,46.99 16.13,47.5 16.13,51.05 16.59,51.51 18.22,51.51 20.05,53.34 BATT.3
CELL_4  (via drill 0.35)
  Top 0.305: U1.8 20.27,39.74 20.27,38.92 19.02,37.66 15.62,37.66 15.04,38.24 14.95,38.24 v14.15,39.04
  Bottom 0.305: BATT.2 22.59,53.34 20.3,51.05 16.78,51.05 16.59,50.87 16.59,47.69 17.09,47.18 17.09,41.15 14.99,39.04 v14.15,39.04
E
  Bottom 0.305: U4.24 41.03,19.9 R8.1 43.35,20.24 R7.2
ECHO
  Bottom 0.305: R8.2 44.24,18.2 45.04,19.01 48.94,19.01 52.08,22.15 53.07,22.15 53.77,21.45 53.77,17.92 53.07,17.22 52.87,17.22 51.38,15.73 51.38,13.89 SONIC.2
GIMBAL_X  (via drill 0.4)
  Top 0.305: U1.37 18.32,23.79 v17.65,23.12 | v27.12,10.16 27.12,9.84 25.71,8.42 25.71,5.17 26.12,4.75 26.71,4.75 27.24,5.28 v30.99,5.28 | v53.29,37.31 51.05,39.55 50.25,39.55 49.53,40.27 v49.53,43.36 | v50.29,45.09 49.57,45.09 48.12,46.53 47.04,46.53 v45.34,44.83 | v20.75,23.88 23.62,21.01 24.06,21.01 24.8,20.26 v24.8,18.88
  Bottom 0.305: v17.65,23.12 17.87,23.12 18.31,23.57 20.45,23.57 v20.75,23.88 | v30.99,5.28 31.24,5.53 42.89,5.53 43.96,6.6 51.91,6.6 52.08,6.43 53.07,6.43 54.86,8.22 54.86,33.84 53.29,35.42 v53.29,37.31 | v49.53,43.36 49.53,44.32 v50.29,45.09 | v45.34,44.83 44.63,45.54 44.63,48.7 44,49.33 43.12,49.33 42.49,48.7 42.49,48.48 41.21,47.19 39.04,47.19 GIMB_X.3 | v24.8,18.88 27.12,16.56 v27.12,10.16
GIMBAL_Y  (via drill 0.4)
  Top 0.305: U1.38 18.82,23.07 v18.61,22.86 | v21.93,16.51 23.45,18.03 v23.49,18.03 | v26.42,7.41 v26.42,5.46 | v43.05,6.7 43.05,8.01 43.8,8.75 43.8,9.4 v44.22,9.82 | v49.58,9.85 50.47,8.96 v50.8,8.96 | GIMB_Y.3 42.05,48.26 43.12,47.19 45.05,47.19 47.18,49.33 48.07,49.33 50.61,46.79 52.89,46.79 53.52,46.16 53.52,45.28 52.89,44.65 52.42,44.65 50.55,42.78 v50.55,40.26
  Bottom 0.305: v21.93,16.51 19.57,18.87 18.1,18.87 17.48,19.5 17.48,20.38 18.61,21.51 v18.61,22.86 | v23.49,18.03 26.42,15.11 v26.42,7.41 | v43.05,6.7 43.04,6.7 42.33,5.99 26.94,5.99 v26.42,5.46 | v44.22,9.82 49.55,9.82 v49.58,9.85 | v50.8,8.96 v50.8,8.97 53.07,8.97 54.4,10.3 54.4,23.36 53.07,24.69 52.24,24.69 51.38,25.54 51.38,29.85 52.42,30.89 53.04,30.89 53.7,31.54 53.7,32.47 53.04,33.12 52.42,33.12 51.16,34.39 51.16,39.65 v50.55,40.26
GIMBAL_Z  (via drill 0.4)
  Top 0.305: U1.39 19.32,22.35 17.48,20.51 17.48,19.5 18.92,18.05 v18.92,18.03 | v51.18,17.78 51.18,18.8 48.44,21.54 48.44,22.47 47.74,23.16 46.9,23.16 46.05,24.02 46.05,30.89 48.82,33.66 48.82,35.51 48.42,35.91 47.75,35.91 45.85,37.81 v45.85,39.55 | v44.22,10.95 43.34,10.07 43.34,8.94 42.04,7.64 v42.04,6.7
  Bottom 0.305: v18.92,18.03 22.11,14.84 22.11,10.07 25.48,6.7 v42.04,6.7 | v44.22,10.95 51.05,17.78 v51.18,17.78 | GIMB_Z.3 43.56,44.88 45.85,42.6 v45.85,39.55
GND  (via drill 0.35, 0.4)  (1 unrouted)
  Top 0.305: IC2.7 42.72,33.01 42.51,33.01 41.55,33.97 40.64,33.97 | 40.64,33.97 C34.2 | 42.64,36.99 C35.2 42.61,37.02 v40.77,38.86 37.91,38.86 C26.2 31.37,38.54 | 42.64,36.99 40.64,34.99 40.64,33.97 | IC2.1 44.49,35.14 42.64,36.99 | M1.1 M4.1 | 33.15,2.29 J2.MT1 33.08,4.19 30.47,6.8 C22.2 | 33.15,2.29 J2.P$1 J2.MT2 42.61,3.81 v42.67,3.81 41.15,2.29 J2.P$2 | C7.2 13.59,26.68 12.28,27.99 12.28,28.7 | 12.28,28.7 12.28,29.43 13.59,30.74 14.27,30.74 U1.31 14.36,30.74 15.04,30.74 15.34,30.44 v15.34,29.49 | 27.42,27.56 C3.2 | J1.6 v20.2,11.31 v20.19,11.3 | RESET.P$2 52.61,4.7 v53.34,4.7 | IC1.26 IC1.25 | IC1.25 39.16,18.28 v39.75,17.69 | U1.47 23.36,28.24 23.36,27.56 25.98,24.95 27.22,24.95 | 27.22,24.95 27.63,25.36 27.63,25.95 27.49,26.09 C3.2 | IC1.18 37.4,13.59 v35.69,13.59 | IC1.21 39.19,15.68 v39.62,15.24 | J2.GND 38.75,4.57 v39.12,4.57 | UART_ARDU.3 52.58,24.35 53.77,25.54 53.77,26.53 52.58,27.72 ISP1.6 52.25,29.46 50.63,27.84 48.03,27.84 OSD.3 | C25.2 C24.2 | 31.91,36 C24.2 | 12.28,28.7 11.18,28.7 v10.8,29.08 | v8.89,41.53 8.89,40.7 C4.2 12.3,37.29 U1.18 | v10.59,45.47 10.59,47.46 10.24,47.82 10.24,48.7 10.86,49.33 11.74,49.33 12.37,48.7 12.37,46.11 C6.2 C5.2 14.73,45.71 15.79,44.66 15.79,43.88 18.27,41.4 18.27,39.83 U1.12 | C8.2 24.26,49.21 v24.26,50.29 | v20.65,22.17 22.48,20.34 v22.48,18.06 | v25.68,14.63 25.68,12.12 26.64,11.15 | v32.99,34.75 31.85,35.89 C24.2 | LED_1.C 4.19,8.61 | D2.1 41.34,12.61 C18.2 39.62,14.92 v39.62,15.24 | U1.63 26.5,37.29 26.72,37.51 26.72,37.83 C2.2 29.59,38.54 31.37,38.54 | 23.49,48.38 24.7,47.18 24.7,46.28 25.58,45.39 25.58,44.04 24.33,42.78 Y1.2 | C8.2 C9.2
  Top 0.305: v27.94,25.78 27.49,26.23 C3.2 | C3.2 27.62,27.69 33.72,27.69 C31.2 37.47,24.06 C27.2 | C27.2 37.72,25.21 C20.2 | U3.18 33.57,31.5 v32.38,31.5 | 26.64,11.15 26.64,10.68 25.25,9.29 25.25,4.98 25.93,4.3 31.14,4.3 33.15,2.29 | v29.84,10.54 29.32,10.54 28.89,10.97 26.82,10.97 26.64,11.15 | v28.57,13.08 28.19,13.46 C19.2 29.34,16.33 IC1.7 | U2.2 30.76,45.47 v31.75,45.47 | BATT.1 29.23,53.34 U2.4 | LED_3.C LED_2.C LED_1.C | RPI_I2C.1 4.17,12.42 ON.C LED_1.C | C27.2 39.11,24.06 v39.17,24 | 27.22,24.95 28.71,24.95 C32.2 29.65,22.42 v28.83,23.24 | IC1.25 37.39,18.13 36.66,18.13 36.48,17.95 36.48,16 36.66,15.82 39.04,15.82 v39.62,15.24 | 31.37,38.54 31.37,38.92 v31.62,39.18 | SONIC.1 50.99,16.83 50.99,16.84 49.34,18.48 | v48.64,20.19 48.64,19.19 49.34,18.48 | 49.34,18.48 48.96,18.48 v48.57,18.09 | U3.11 34.77,34.78 34.77,35.24 33.83,36.17 33.83,36.56 33.43,36.96 32.86,36.96 31.91,36 | 31.91,36 C24.2 | Y1.4 22.44,46.52 22.44,47.32 23.49,48.38 | 23.49,48.38 C8.2
  Bottom 0.305: v20.19,11.3 20.19,10.91 20.23,10.87 20.23,9.32 19.18,8.26 C16.2 | v39.12,4.57 41.91,4.57 v42.67,3.81 | R1.2 21.94,36.25 21.94,36.68 24.44,39.18 v31.62,39.18 C23.2 | v10.8,29.08 6.48,29.08 U$1.GND | v8.89,41.53 8.89,43.76 v10.59,45.47 | v24.26,50.29 24.32,50.35 C15.2 | v15.34,29.49 16.39,30.55 C1.2 | v20.65,22.17 18.59,20.12 USB/OSD.1 | v22.48,18.06 22.48,17.83 v25.68,14.63 | 2.59,54.41 2.65,54.48 | v29.84,10.54 28.57,11.81 v28.57,13.08 | U4.21 41.56,22.97 41.83,22.69 43.46,22.69 C28.2 | U4.5 30.27,23.77 Y2.4 29.65,24.06 v28.83,23.24 | v48.57,18.09 47.39,18.09 47.27,18.21 46.71,18.21 46.7,18.2 R9.1
  pour Bottom: 0,56.01 56.39,56.01 56.52,55.88 56.52,0.13 56.39,0 0.25,0 0.13,0.13 0.13,55.88
GPS_RX  (via drill 0.35)
  Top 0.305: v27.85,41.73 28.9,40.68 29.28,40.68 29.7,40.26 GPS.2 | v12.63,31.03 13.39,31.79 U1.29
  Bottom 0.305: v12.63,31.03 12.46,31.19 11.91,31.19 11.51,31.59 11.51,33.76 20.81,43.06 28.78,43.06 29.18,42.66 29.18,42.09 28.78,41.69 27.89,41.69 v27.85,41.73
GPS_TX  (via drill 0.35)
  Top 0.305: v28.49,42.37 30.02,40.84 46.52,40.84 47.13,41.45 48.12,41.45 48.82,40.75 48.82,39.77 47.62,38.57 GPS.1 | v12.19,31.88 12.6,32.29 U1.28
  Bottom 0.305: v28.49,42.37 28.17,42.37 28.13,42.41 20.81,42.41 12.39,33.99 12.39,32.08 v12.19,31.88
IMU_INT  (via drill 0.35)
  Top 0.305: U3.12 33.15,35.9 v33.15,36.27 | v24.38,32.77 24.4,32.79 U1.54
  Bottom 0.305: v33.15,36.27 32.21,37.21 27.18,37.21 24.38,34.42 v24.38,32.77
IMU_MISO
  Top 0.305: U3.9 35.77,34.78 35.77,36.83 35,37.59 29.22,37.59 28.24,36.61 28.24,32.39 27.64,31.79 U1.52
IMU_MOSI
  Top 0.305: U3.24 36.77,30.75 36.77,30 35.69,28.93 25.35,28.93 24.46,29.82 24.46,31.61 25.09,32.24 25.77,32.24 U1.53
IMU_NSS
  Top 0.305: U1.50 33.36,30.79 34.05,30.1 35.57,30.1 35.74,30.28 35.74,30.73 U3.22
IMU_SCK
  Top 0.305: U3.23 36.27,30.75 36.27,30.15 35.5,29.39 25.54,29.39 24.91,30.01 24.91,31.07 25.09,31.24 25.77,31.24 U1.51
LED_1  (via drill 0.35)
  Top 0.305: v27.94,37.89 27.94,36.96 26.72,35.73 26.72,34.51 26.5,34.29 U1.57
  Bottom 0.305: R15.2 15.46,13.21 15.46,24.83 16.34,25.72 18.17,25.72 22.3,29.85 22.3,30.33 22.4,30.43 22.4,36.49 23.57,37.67 27.71,37.67 v27.94,37.89
LED_2  (via drill 0.35)
  Top 0.305: v27.56,33.91 27.44,33.79 U1.56
  Bottom 0.305: R16.2 11.52,7.79 10.71,8.59 10.71,9.95 10.89,10.13 11.57,10.13 15,13.56 15,25.02 20.23,30.25 20.23,31.65 20.41,31.83 21.67,31.83 21.94,32.1 21.94,33.9 20.7,35.14 20.7,36.49 24.34,40.13 35.67,40.13 35.85,39.95 35.85,35.78 33.99,33.91 v27.56,33.91
LED_3  (via drill 0.35)
  Top 0.305: U1.55 27.17,33.29 v27.56,32.89 | v13.99,14.48 13.03,13.52 12.63,13.12 12.63,12.55 12.64,12.54 v12.64,8.57
  Bottom 0.305: v27.56,32.89 27.89,33.23 33.95,33.23 36.31,35.59 36.31,40.14 35.86,40.59 24.15,40.59 19.22,35.66 19.22,33.96 19.04,33.78 18.5,33.78 18.07,33.35 18.07,28.74 14.32,24.99 v14.32,19.05 14.32,14.8 v13.99,14.48 | v12.64,8.57 12.32,8.26 12.32,6.44 11.52,5.63 R17.2
LED_RX
  Top 0.305: IC1.23 41.74,16.98 R14.1
LED_TX
  Top 0.305: IC1.22 40.23,16.33 R13.1
MOT_1
  Top 0.305: M1.3 11.3,42.76 12.38,41.68 14.57,41.68 15.48,40.77 15.85,41.15 16.78,41.15 17.27,40.66 17.27,39.83 U1.14
MOT_2
  Top 0.305: M2.3 8.51,44.91 12.19,41.22 14.38,41.22 15.36,40.25 15.6,40.25 16.04,40.69 16.59,40.69 16.77,40.51 16.77,39.83 U1.15
MOT_3
  Top 0.305: U1.16 15.17,39.79 14.19,40.77 11.98,40.77 5.71,47.03 M3.3
MOT_4
  Top 0.305: U1.17 13.68,37.79 3.21,48.26 M4.3
N$1  (via drill 0.35)
  Top 0.305: U1.30 15.16,31.29 v15.49,31.62
  Bottom 0.305: v15.49,31.62 16.32,32.45 C1.1
N$2
  Top 0.305: IC1.2 30.14,19.43 29.41,19.43 C17.1
N$3
  Top 0.305: U1.6 21.27,39.83 21.27,40.51 20.63,41.15 Y1.1 19.37,43.67 19.37,45.39 19.55,45.57 19.59,45.57 C9.1
N$4  (via drill 0.35)
  Top 0.305: U1.60 25.79,35.81 v24.38,35.81
  Bottom 0.305: v24.38,35.81 R1.1
N$5
  Top 0.305: IC1.17 37.66,13.21 C18.1
N$6  (via drill 0.35)
  Top 0.305: U3.10 35.27,34.78 35.27,35.38 35.02,35.63 v35.02,35.97
  Bottom 0.305: C23.1 35.02,37.05 v35.02,35.97
N$8
  Bottom 0.305: U4.20 42.59,23.77 C28.1
N$9
  Bottom 0.305: C29.2 28.01,23.73 Y2.1 28.99,25.37 U4.7
N$10
  Bottom 0.305: C30.1 29.91,27.83 Y2.3 30.18,27.76 U4.8
N$12
  Bottom 0.305: R7.1 45.72,20.92 R9.2
N$14
  Top 0.305: R13.2 46.46,13.34 LED_TX.C
N$16
  Top 0.305: R14.2 45.05,15.62 LED_RX.C
N$17  (via drill 0.35)
  Top 0.305: LED_1.A 7.87,8.64 v8.51,9.27
  Bottom 0.305: v8.51,9.27 R15.1
N$18  (via drill 0.35)
  Top 0.305: v8.51,7.11 7.49,6.1 LED_2.A
  Bottom 0.305: v8.51,7.11 R16.1
N$19  (via drill 0.35)
  Top 0.305: v8.51,4.95 7.11,3.56 LED_3.A
  Bottom 0.305: v8.51,4.95 9.69,4.95 R17.1
N$20  (via drill 0.35)
  Top 0.305: v8.51,11.3 8.38,11.18 ON.A
  Bottom 0.305: v8.51,11.3 8.76,11.56 R18.1
N$49
  Top 0.305: U1.5 21.82,41.67 21.88,41.74 21.88,42.27 Y1.3 24.33,45.71 C8.1
RF24_CE
  Top 0.305: U1.24 12.98,34.29 11.11,32.41 7.52,32.41 5.71,30.61 U$1.CE
RF24_INT
  Top 0.305: U1.25 13.13,33.79 11.3,31.95 7.71,31.95 6.71,30.95 6.71,30.09 5.98,29.36 2.4,29.36 1.68,30.09 1.68,31.12 2.4,31.85 3.39,31.85 4.17,32.63 4.17,34.44 U$1.IRQ
RF24_MISO  (via drill 0.35)
  Top 0.305: U1.22 12.69,35.29 12.56,35.15 11.43,35.15 v11.21,34.93
  Bottom 0.305: v11.21,34.93 10.45,35.69 U$1.MISO
RF24_MOSI  (via drill 0.35)
  Top 0.305: U1.23 12.84,34.79 12.3,34.24 10.52,34.24 v10.05,33.77
  Bottom 0.305: v10.05,33.77 8.73,33.77 8.1,34.39 4.17,34.39 U$1.MOSI
RF24_NSS
  Top 0.305: U1.20 12.4,36.29 12.18,36.07 10.41,36.07 6.2,31.85 4.94,31.85 3.7,30.61 U$1.CSN
RF24_SCK  (via drill 0.35)
  Top 0.305: U1.21 12.54,35.79 12.37,35.61 10.92,35.61 v8.42,33.11
  Bottom 0.305: v8.42,33.11 5.5,33.11 U$1.SCK
RNG_ADC  (via drill 0.35)
  Top 0.305: RNG.3 44.91,45.54 35.56,45.54 33.43,47.67 28.16,47.67 27.7,47.21 27.7,43.7 24.46,40.46 24.46,39.14 21.85,36.53 21.85,34.49 v21.11,33.76 | v19.9,34.54 18.64,33.29 U1.26
  Bottom 0.305: v19.9,34.54 20.32,34.54 v21.11,33.76
RPI_SCL  (via drill 0.35)
  Top 0.305: U1.41 20.32,29.08 v20.95,29.72 20.14,29.72 19.21,30.66 17.5,30.66 15.28,28.43 15.28,25.71 14.72,25.15 11.81,25.15 RPI_I2C.3
  Bottom 0.305: v20.95,29.72 20.95,30.9 R4.1
RPI_SDA  (via drill 0.35)
  Top 0.305: v18.92,29.97 18.92,29.86 19.77,29.01 19.77,28.33 U1.40 19.82,16.64 22.9,13.55 22.92,13.55 23.1,13.37 23.1,11.62 21.85,10.37 15.25,10.37 13.99,11.62 13.99,13.37 15.03,14.42 15.03,19.3 14.6,19.73 9.19,19.73 7.31,17.86 4.38,17.86 3.76,18.48 3.76,19.37 5.59,21.19 RPI_I2C.4
  Bottom 0.305: v18.92,29.97 R5.1
RST  (via drill 0.35)
  Top 0.305: U1.7 20.82,38.47 v20.45,38.1 | 35.69,22.26 R6.1 35.69,22.14 34.46,20.91 34.46,19.23 32.69,17.46 32.69,12.8 31.16,11.27 29.41,11.27 27.14,13.54 27.14,18.65 C17.2 24.19,17.27 24.19,1.34 23.14,1.34 23.14,2.68 17.93,7.89 12.35,7.89 11.95,8.29 11.95,13.09 13.08,14.22 v13.08,18.8 | 35.69,22.26 37.62,22.26 C27.1 | RESET.P$1 44.93,11.71 44.02,12.62 44.02,16.17 41.1,19.09 v40.49,19.09 | v35.69,20.96 35.69,22.26
  Bottom 0.305: v20.45,38.1 18.98,36.64 C10.1 13.77,32.24 13.77,30.55 13.08,29.87 v13.08,18.8 | U4.29 35.67,20.94 | 35.67,20.94 v35.69,20.96 | 35.67,20.94 38.65,20.94 v40.49,19.09 44.36,19.09 44.54,19.27 44.54,20.53 44.24,20.83 44.24,22.27 44.67,22.69 45.29,22.69 46.05,23.46 46.05,25.01 46.75,25.71 47.59,25.71 50.04,28.16 ISP1.5 | 35.67,20.94 35.67,23.91 32.68,26.9 32.68,28.42 39.95,35.68 44.95,35.68 46.43,37.16 46.43,38.21 47.13,38.91 48.18,38.91 JTAG.2
SD_MISO  (via drill 0.35)
  Top 0.305: U1.35 17.32,24.76 v16.6,24.04 | v21.34,14.1 21.34,12.54 J1.7
  Bottom 0.305: v16.6,24.04 16.6,18.83 v21.34,14.1
SD_MOSI
  Top 0.305: J1.3 16.9,23.37 17.82,24.29 U1.36
SD_NSS
  Top 0.305: J1.2 15.8,27.77 U1.33
SD_SCK  (via drill 0.35)
  Top 0.305: U1.34 16.82,25.23 v16.62,25.03 | v19.05,13.97 19.1,13.92 J1.5
  Bottom 0.305: v16.62,25.03 15.92,24.32 15.92,17.1 v19.05,13.97
SWCLK  (via drill 0.35)
  Top 0.305: U1.49 31.56,30.29 v31.75,30.1 | v46.2,43.39 46.2,43.28 44.58,41.65 v44.58,41.53
  Bottom 0.305: JTAG.5 51.31,49.66 51.31,47.33 47.97,43.99 47.13,43.99 46.52,43.39 v46.2,43.39 | v44.58,41.53 40.05,37 40.05,36.93 33.22,30.1 v31.75,30.1
SWDIO
  Top 0.305: U1.46 22.82,29.05 22.3,29.56 22.3,36.34 24.91,38.95 24.91,40.27 28.71,44.07 50.8,44.07 JTAG.3
TRIG  (via drill 0.35)
  Top 0.305: v41.91,21.34 46.42,16.83 47.51,16.83 48.32,16.01 48.32,12.43 48.5,12.26 50.48,12.26 SONIC.3
  Bottom 0.305: U4.23 41.88,21.37 v41.91,21.34
USBDM  (via drill 0.35)
  Top 0.305: IC1.16 37.39,12.28 36.66,12.28 36.43,12.06 36.43,10.16 | 36.43,10.16 J2.D- | D2.2 39.58,10.16 v38.1,10.16 | v36.4,10.16 36.43,10.16
  Bottom 0.305: v38.1,10.16 v36.4,10.16
USBDP
  Top 0.305: J2.D+ 37.08,8.51 | 37.08,8.51 37.08,11.33 IC1.15 | 37.08,8.51 37.99,9.41 D2.3
USBOSD  (via drill 0.35)
  Top 0.305: U1.45 22.36,28.24 22.36,27.56 22.54,27.38 22.57,27.38 v22.9,27.05
  Bottom 0.305: v22.9,27.05 22.9,21.76 USB/OSD.2
USBOSD_RX  (via drill 0.35)
  Top 0.305: IC1.1 29.38,20.23 v23.87,25.73 21.79,25.73 21.36,26.17 21.36,28.24 U1.43 | OSD.2 52.15,19.61 53.07,19.61 53.85,18.83 53.85,17.02 v53.72,16.89
  Bottom 0.305: v53.72,16.89 53.77,16.84 53.77,12.21 53.07,11.51 52.24,11.51 48.14,7.41 32.71,7.41 31.25,8.86 31.25,13.19 30.88,13.56 30.88,14.32 24.19,21.01 24.19,25.41 v23.87,25.73
USBOSD_TX  (via drill 0.35)
  Top 0.305: v26.1,22.54 23.36,25.28 21.6,25.28 20.82,26.06 U1.42 | IC1.5 31.98,17.63 v32,17.65 32,14.28 v31.57,13.84 | v45.61,8.26 51.52,8.26 52.08,8.81 52.92,8.81 53.77,9.67 53.77,10.65 53.07,11.35 52.24,11.35 50.53,13.06 50.53,16.65 50.35,16.83 48.87,16.83 47.45,18.25 47.45,19.73 47.24,19.94 OSD.1
  Bottom 0.305: v32,17.65 29.12,20.54 27.23,20.54 27.05,20.71 27.05,21.59 v26.1,22.54 | v31.57,13.84 31.71,13.7 31.71,9.05 32.9,7.86 34.95,7.86 35.35,8.26 v45.61,8.26
V_USB  (via drill 0.35)
  Top 0.305: v35.56,9.27 35.78,9.05 J2.VBUS 35.83,4.89 35.83,4.24 36.51,3.55 39.88,3.55 39.88,6.56 D2.4
  Bottom 0.508: v35.56,9.27 35.31,9.02 D1.A
VCC_1  (via drill 0.35, 0.4)  (7 unrouted)
  Top 0.305: U1.32 13.59,29.56 C7.1 13.59,28.44 14.64,27.39 14.64,25.83 14.46,25.65 10.73,25.65 9.08,24 RPI_I2C.5 2.92,26.67 U$1.VCC | U1.48 24.54,27.56 | U1.64 26.61,38.58 C2.1 | C4.1 10.91,36.79 U1.19 18.62,36.79 20.58,34.83 20.58,34.26 20.07,33.74 v20.07,33.63 | C6.1 C5.1 14.73,43.84 17.77,40.8 17.77,39.83 U1.13 | C31.1 v33.78,24.26 | U2.3 33.05,46.89 v33.15,46.99 | J1.4 17.78,12.48 v17.78,11.3 | IC2.6 42.77,32.07 C34.1 C20.1 41.34,29.91 v43.31,27.94 | IC2.8 42.67,33.7 C35.1 | IC1.4 30.14,18.13 29.41,18.13 28.35,17.08 C19.1 | U3.13 31.71,34.02 C24.1 C25.1 | U3.8 36.31,35.36 C26.1 38.04,36.64 v39.24,37.85 | v26.92,25.65 26.92,26.23 C3.1 25.68,27.43 25.68,27.41 | v33.27,23.11 32.07,24.32 C32.1
  Bottom 0.305: U4.18 40.58,25.58 41.12,25.58 41.7,26.16 C33.1 | U4.4 31.92,23.11 v33.27,23.11 33.78,23.62 v33.78,24.26 33.47,24.57 U4.6 31.56,24.35 | C13.1 C11.1 35.63,48.45 GIMB_X.2 GIMB_Z.2 47.62,46.74 GPS.4 | C13.1 C12.1 | v33.15,46.99 33.15,48.33 C13.1 | C16.1 19.18,11.3 v17.78,11.3 12.78,6.3 12.78,4.61 12.14,3.97 10.89,3.97 10.71,4.15 10.71,7.7 9.99,8.42 8.4,8.42 7.83,8.99 7.83,9.55 8.4,10.13 10.09,10.13 R18.2 10.16,12.91 v10.16,13.08 | ISP1.2 52.58,37.61 53.52,38.55 53.52,52.27 JTAG.6 | R2.2 R3.2 39.46,16.89 v44.45,16.89 | C33.1 45.36,28.91 45.37,28.91 46.05,29.59 OSD.4 | C33.1 42.61,27.24 v43.31,27.94 | R5.2 20.07,32.73 | 20.07,32.73 R4.2 | 20.07,32.73 v20.07,33.63 | v39.24,37.85 40.08,38.69 40.08,39.15 40.64,39.7 BUZZER.2
  pour Top: 0,55.88 56.26,55.88 56.39,56.01 56.39,0.13 56.52,0 0.25,0 0,-0.25
VCC_2  (via drill 0.35, 0.4)
  Top 0.305: v28.45,46.99 28.42,46.99 U2.1 | IC1.20 34.46,15.03 v34.29,14.86 | C22.1 28.07,8.95 v28.07,10.29 28.92,10.29 29.35,9.86 31.7,9.86 v33.02,11.18 | v14.22,50.55 13.97,50.8 M1.2 M2.2 M3.2 M4.2 | v45.08,29.59 45.59,29.08 45.59,20.94 46.99,19.55 v46.99,17.53 47.52,17.53 LED_RX.A LED_TX.A | SONIC.4 54.55,9.59 54.55,30.86 | 54.55,30.86 54.55,48.07 52.88,49.73 52.01,49.73 50.94,50.8 RNG.2 45.07,50.8 44,49.73 27.76,49.73 v25.4,47.37 | v50.8,30.86 54.55,30.86
  Bottom 0.305: C15.1 C14.1 28.7,47.24 v28.45,46.99 | v34.29,14.86 32.83,14.86 C21.1 | D1.C 28.56,10.29 v28.07,10.29 | v14.22,50.55 14.22,42.39 12.76,40.92 12.76,39.47 13.87,38.36 14.95,38.36 25.05,48.45 C15.1 | v45.08,29.59 46.36,30.86 v50.8,30.86 | v25.4,47.37 26.48,48.45 C15.1 | v33.02,11.18 33.02,11.32 33.82,12.12 33.82,14.39 v34.29,14.86 | v34.29,14.86 34.88,14.86 35.21,14.53 43.63,14.53 43.81,14.35 v46.99,17.53